# EAGLE design RadioMusic_B (EAGLE 9.4.1)
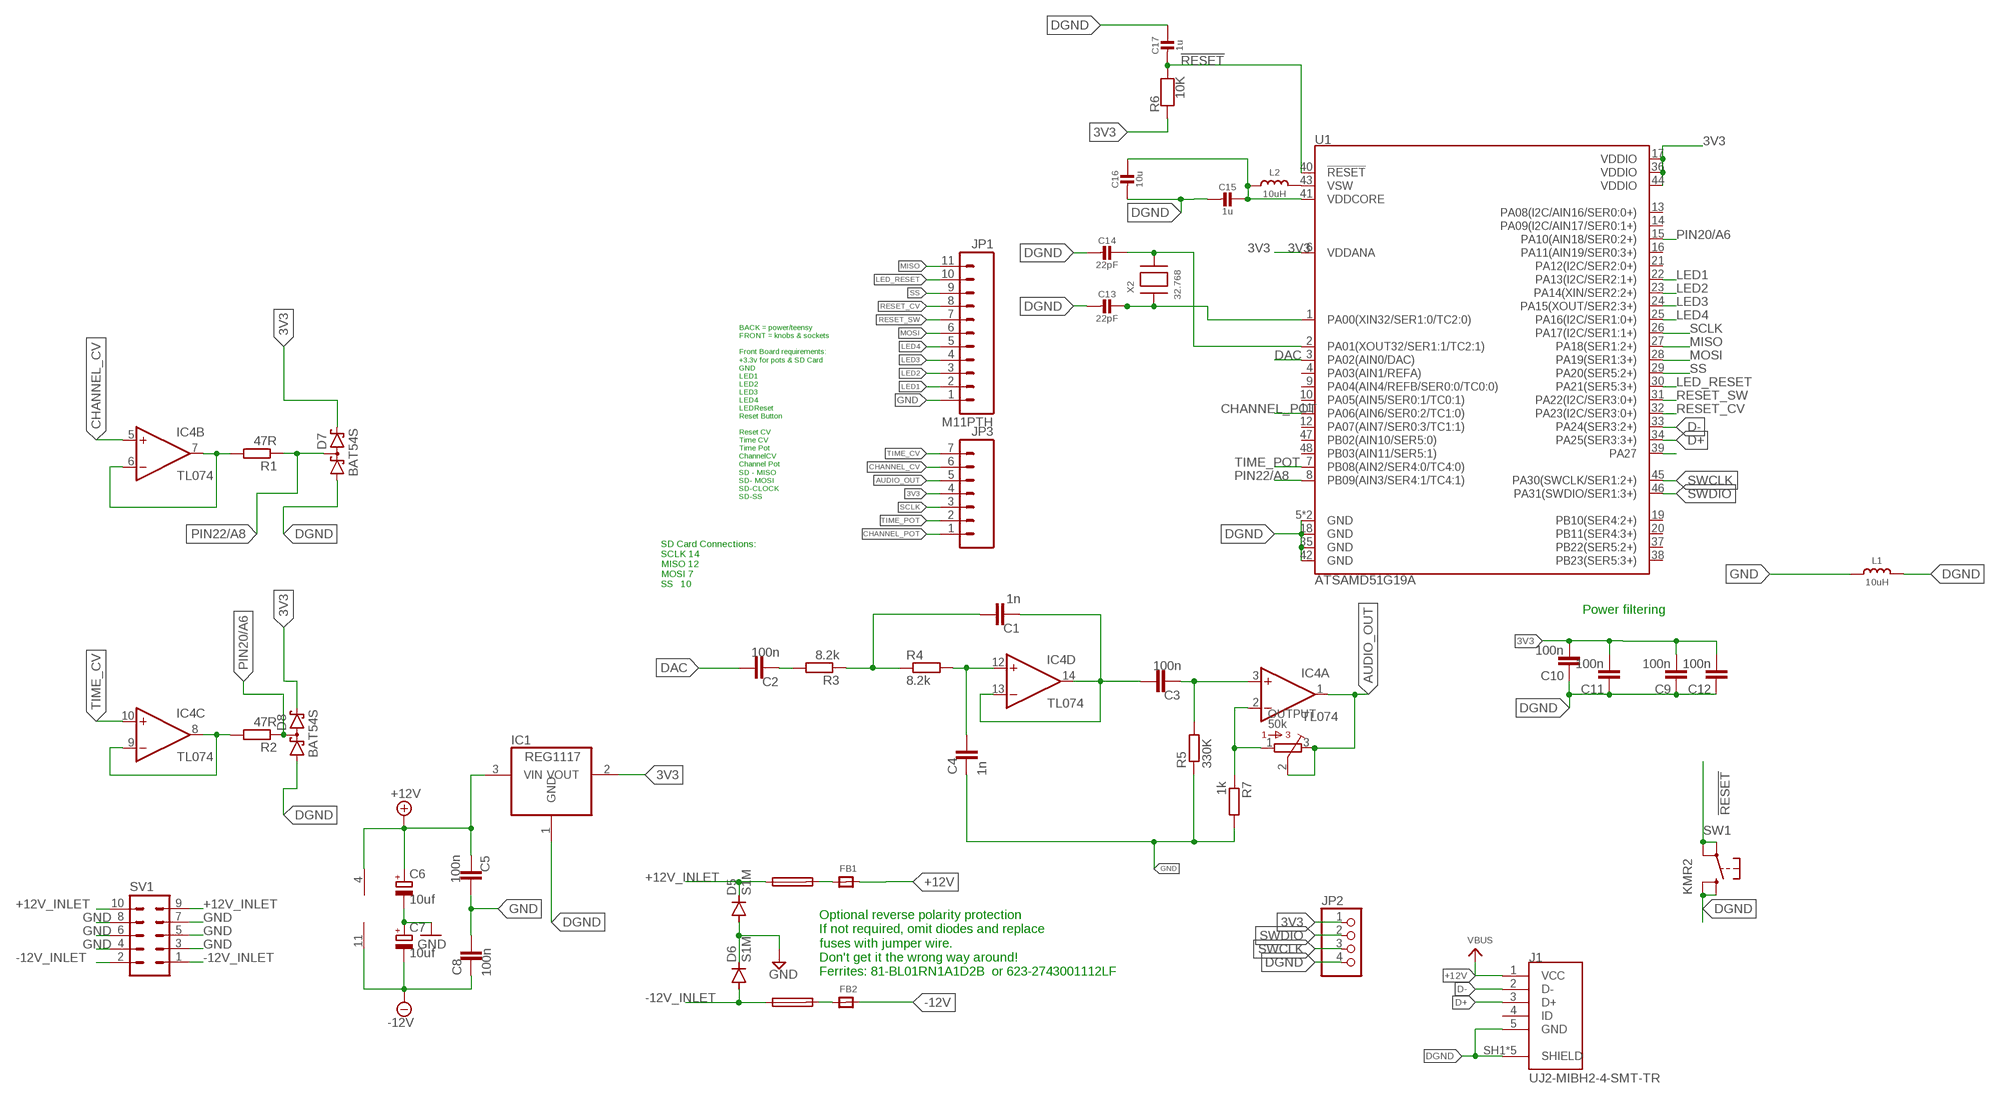
[diagram p0: schematic, sheet 1]

## Parts
C1  1n  C-EUC0603  [C0603]
C2  100n  C-EUC0603  [C0603]
C3  100n  C-EUC0603  [C0603]
C4  1n  C-EUC0603  [C0603]
C5  100n  C-EUC0603  [C0603]
C6  10uf  CPOL-EUB  [PANASONIC_B]
C7  10uf  CPOL-EUB  [PANASONIC_B]
C8  100n  C-EUC0603  [C0603]
C9  100n  C-EUC0603  [C0603]
C10  100n  C-EUC0603  [C0603]
C11  100n  C-EUC0603  [C0603]
C12  100n  C-EUC0603  [C0603]
C13  22pF  CAP_CERAMIC0603_NO  [0603-NO]
C14  22pF  CAP_CERAMIC0603_NO  [0603-NO]
C15  1u  CAP_CERAMIC0603_NO  [0603-NO]
C16  10u  CAP_CERAMIC0805-NOOUTLINE  [0805-NO]
C17  1u  CAP_CERAMIC0603_NO  [0603-NO]
D5  S1M  [SMA]
D6  S1M  [SMA]
D7  BAT54S  [SOT23]
D8  BAT54S  [SOT23]
F1  FUSE  [F1206]
F2  FUSE  [F1206]
FB1  FERRITE_0805  [_0805]
FB2  FERRITE_0805  [_0805]
IC1  REG1117  [SOT223]
IC4  TL074  TL074_SMD  [SO14]
J1  UJ2-MIBH2-4-SMT-TR  [CUI_UJ2-MIBH2-4-SMT-TR]
JP1  M11PTH  [1X11]
JP2  PINHD-1X4  [1X04]
JP3  M07  [1X07]
L1  10uH  INDUCTOR  [INDUCTOR_1007]
L2  10uH  INDUCTOR  [INDUCTOR_1007]
OUTPUT  50k  3362P  [3362P]
R1  47R  R-EU_R0603  [R0603]
R2  47R  R-EU_R0603  [R0603]
R3  8.2k  R-EU_R0603  [R0603]
R4  8.2k  R-EU_R0603  [R0603]
R5  330K  R-EU_R0603  [R0603]
R6  10K  RESISTOR_0603_NOOUT  [0603-NO]
R7  1k  R-EU_R0603  [R0603]
SV1  10_PIN_HEADER  [MA05-2]
SW1  KMR2  SWITCH_TACT_SMT4.6X2.8  [BTN_KMR2_4.6X2.8]
U1  ATSAMD51G19A  [QFN-48]
X2  32.768  XTAL-3.2X1.5  [XTAL3215]

## Nets
3V3: C9.2 C10.2 C11.2 C12.2 C15.1 C16.1 D7.2(C2) D8.2(C2) IC1.2(VOUT) JP2.1 JP3.4 L2.P$1 R6.1 U1.6(VDDANA) U1.17(VDDIO) U1.36(VDDIO) U1.41(VDDCORE) U1.44(VDDIO)
!RESET: C17.2 R6.2 SW1.A'(P1) SW1.A(P) U1.40(!RESET!)
+12V [power]: C5.2 C6.+ FB1.2 IC1.3(VIN) IC4.4(P:V+) J1.1(VCC) ; supply symbol labelled VBUS
+12V_INLET [power]: D5.C F1.1 SV1.9 SV1.10
-12V [power]: C7.- C8.2 FB2.2 IC4.11(P:V-)
-12V_INLET [power]: D6.A F2.1 SV1.1 SV1.2
AUDIO_OUT: IC4.1(A:OUT) JP3.5 OUTPUT.2 OUTPUT.3
CHANNEL_CV: IC4.5(B:+IN) JP3.6
CHANNEL_POT: JP3.1 U1.11(PA06(AIN6/SER0:2/TC1:0))
D+: J1.3(D+) U1.34(PA25(SER3:3+))
D-: J1.2(D-) U1.33(PA24(SER3:2+))
DAC: C2.1 U1.3(PA02(AIN0/DAC))
DGND: C9.1 C10.1 C11.1 C12.1 C13.2 C14.2 C15.2 C16.2 C17.1 D7.1(A1) D8.1(A1) IC1.1(GND) J1.5(GND) J1.SH1(SHIELD) J1.SH2(SHIELD) J1.SH3(SHIELD) J1.SH4(SHIELD) J1.SH5(SHIELD) JP2.4 L1.P$2 SW1.B'(S1) SW1.B(S) U1.5(GND) U1.18(GND) U1.35(GND) U1.42(GND) U1.EP(GND)
GND [gnd]: C4.2 C5.1 C6.- C7.+ C8.1 D5.A D6.C JP1.1 L1.P$1 R5.1 R7.2 SV1.3 SV1.4 SV1.5 SV1.6 SV1.7 SV1.8
LED1: JP1.2 U1.22(PA13(I2C/SER2:1+))
LED2: JP1.3 U1.23(PA14(XIN/SER2:2+))
LED3: JP1.4 U1.24(PA15(XOUT/SER2:3+))
LED4: JP1.5 U1.25(PA16(I2C/SER1:0+))
LED_RESET: JP1.10 U1.30(PA21(SER5:3+))
MISO: JP1.11 U1.27(PA18(SER1:2+))
MOSI: JP1.6 U1.28(PA19(SER1:3+))
N$1: IC4.8(C:OUT) IC4.9(C:-IN) R2.2
N$2: C4.1 IC4.12(D:+IN) R4.2
N$3: IC4.6(B:-IN) IC4.7(B:OUT) R1.2
N$4: C1.1 R3.1 R4.1
N$5: C1.2 C3.1 IC4.13(D:-IN) IC4.14(D:OUT)
N$6: C3.2 IC4.3(A:+IN) R5.2
N$7: IC4.2(A:-IN) OUTPUT.1 R7.1
N$8: C13.1 U1.1(PA00(XIN32/SER1:0/TC2:0)) X2.P$1
N$9: C14.1 U1.2(PA01(XOUT32/SER1:1/TC2:1)) X2.P$2
N$10: C2.2 R3.2
N$11: L2.P$2 U1.43(VSW)
N$13: U1.39(PA27)
N$22 [power]: F1.2 FB1.1
N$23 [power]: F2.2 FB2.1
PIN20/A6: D8.3(C1A2) R2.1 U1.15(PA10(AIN18/SER0:2+))
PIN22/A8: D7.3(C1A2) R1.1 U1.8(PB09(AIN3/SER4:1/TC4:1))
RESET_CV: JP1.8 U1.32(PA23(I2C/SER3:0+))
RESET_SW: JP1.7 U1.31(PA22(I2C/SER3:0+))
SCLK: JP3.3 U1.26(PA17(I2C/SER1:1+))
SS: JP1.9 U1.29(PA20(SER5:2+))
SWCLK: JP2.3 U1.45(PA30(SWCLK/SER1:2+))
SWDIO: JP2.2 U1.46(PA31(SWDIO/SER1:3+))
TIME_CV: IC4.10(C:+IN) JP3.7
TIME_POT: JP3.2 U1.7(PB08(AIN2/SER4:0/TC4:0))
Unconnected: J1.4(ID) U1.4(PA03(AIN1/REFA)) U1.9(PA04(AIN4/REFB/SER0:0/TC0:0)) U1.10(PA05(AIN5/SER0:1/TC0:1)) U1.12(PA07(AIN7/SER0:3/TC1:1)) U1.13(PA08(I2C/AIN16/SER0:0+)) U1.14(PA09(I2C/AIN17/SER0:1+)) U1.16(PA11(AIN19/SER0:3+)) U1.19(PB10(SER4:2+)) U1.20(PB11(SER4:3+)) U1.21(PA12(I2C/SER2:0+)) U1.37(PB22(SER5:2+)) U1.38(PB23(SER5:3+)) U1.47(PB02(AIN10/SER5:0)) U1.48(PB03(AIN11/SER5:1))

## Notes on the sheet
- BACK = power/teensy
  FRONT = knobs & sockets
  
  Front Board requirements:
  +3.3v for pots & SD Card 
  GND 
  LED1
  LED2
  LED3
  LED4
  LEDReset
  Reset Button
  
  Reset CV 
  Time CV
  Time Pot
  ChannelCV
  Channel Pot
  SD - MISO
  SD- MOSI
  SD-CLOCK
  SD-SS
- SD Card Connections: 
   SCLK 14
   MISO 12
   MOSI 7 
   SS   10
- Power filtering
- Optional reverse polarity protection
  If not required, omit diodes and replace
  fuses with jumper wire. 
  Don't get it the wrong way around! 
  Ferrites: 81-BL01RN1A1D2B  or 623-2743001112LF

## Library data of the parts
C1-C5 C8-C12 = rcl:C-EU: CAPACITOR, European symbol; SPICEPREFIX: C
C6 C7 = rcl:CPOL-EU: POLARIZED CAPACITOR, European symbol; SPICEPREFIX: C
C13-C17 = microbuilder:CAP_CERAMIC: Ceramic Capacitors For new designs, use the packages preceded by an '_' character since they are more reliable: The following footprints should be used on most boards: _0402 - Standard footprint for regular board layouts _0603 - Standard footprint for regular board layouts _0805 - Standard footprint for regular board layouts _1206 - Standard footprint for regular board layouts For extremely tight-pitch boards where space is at a premium, the following 'micro-pitch' footprints can be used (smaller pads, no silkscreen outline, etc.): _0402MP - Micro-pitch footprint for very dense/compact boards _0603MP - Micro-pitch footprint for very dense/compact boards _0805MP - Micro-pitch footprint for very dense/compact boards _1206MP - Micro-pitch footprint for very dense/compact boards
D5 D6 = diode:S1M
D7 D8 = diode:BAT54S: Schottky Diodes Pin connection corrected 2011-05-04 Source: Fairchild .. BAT54.pdf
F1 F2 = _JC:FUSE
FB1 FB2 = microbuilder:FERRITE: Ferrite Bead 0603 MMZ1608B121C - 120 Ohm @ 100MHz, 600mA, 0.15 Ohm DC Resistance - Digikey: 445-2164-1-ND BK1608HW121-T - 120 Ohm, 600mA Ferrite Chip - Digikey: 587-1876-2-ND 0805 HZ0805B272R-10 - 2.7K Ohm @ 100MHz, 200mA, 0.8 Ohm DC Resistance - Digikey: 240-2504-1-ND (see also Murata BLM21BD272SN1L) MMZ2012Y152B - 1.5K Ohm @ 100MHz, 500mA, 0.4 Ohm DC Resistance - Digikey: 445-1560-1-ND - Mainly for high frequency (80-400MHz) MMZ2012R102A - 1K Ohm @ 100MHz, 500mA, 0.3 Ohm DC Resistance - Digikey: 445-1555-2-ND - More general purpose (10-200MHz)
IC1 = burr-brown:REG1117: 800mA and 1A Low Dropout (LDO) Positive Regulator 1.8V, 2.5V, 2.85V, 3.3V, 5V, and Adj; MPN: REG1117; OC_FARNELL: 1097566; OC_NEWARK: 14P6981
IC4 = Foxfield:TL074: Generic Quad Op Amp
J1 = UJ2-MIBH2-4-SMT-TR:UJ2-MIBH2-4-SMT-TR: Micro B Type 5 Pin Horizontal 30 µin Plating SMT USB Jack 2.0; AVAILABILITY: Unavailable; CUI_PURCHASE_URL: https://www.cui.com/product/interconnect/connectors/usb-connectors/uj2-mibh2-4-smt?utm_source=snapeda.com&utm_medium=referral&utm_campaign=snapedaBOM; DESCRIPTION: Micro B, USB 2.0, 1.8 A, Right Angle, Surface Mount _SMT_, USB Receptacle; MF: CUI Inc.; MP: UJ2-MIBH2-4-SMT-TR; PACKAGE: None; PRICE: None
JP1 = SparkFun-Connectors:M11: Header 11 Standard 11-pin 0.1" header. Use with straight break away headers (SKU : PRT-00116), right angle break away headers (PRT-00553), swiss pins (PRT-00743), machine pins (PRT-00117), and female headers (PRT-00115).
JP2 = pinhead:PINHD-1X4: PIN HEADER
JP3 = SparkFun-Connectors:M07: Header 7 Standard 7-pin 0.1" header. Use with straight break away headers (SKU : PRT-00116), right angle break away headers (PRT-00553), swiss pins (PRT-00743), machine pins (PRT-00117), and female headers (PRT-00115). NOTES ON THE VARIANTS LOCK and LOCK_LONGPADS... This footprint was designed to help hold the alignment of a through-hole component (i.e. 7-pin header) while soldering it into place. You may notice that each hole has been shifted either up or down by 0.005 of an inch from it's more standard position (which is usually a perfectly straight line). This slight alteration caused the pins (the squares in the middle) to touch the edges of the holes. Because they are alternating, it causes a "brace" to hold the header in place. 0.005 has proven to be the perfect amount of "off-center" position when using our standard breakaway headers. Although looks a little odd when you look at the bare footprint, once you have a header in there, the alteration is very hard to notice. Also, if you push a header all the way into place, it is covered up entirely on the bottom side. This idea of altering the position of holes to aid alignment will be further integrated into the Sparkfun Library for other footprints. It can help hold any component with 3 or more connection pins.
L1 L2 = microbuilder:INDUCTOR: Inductors 0603: 10nH Ceramic Inductor - microwire antenna/RF (Digikey: 712-1434-2-ND) 0805: 560nH Ceramic Inductor - RF (Digikey: 553-1047-1-ND) 270nH Ceramic Inductor - Q = 40@250MHz, +-5%, 1 Ohm DC Resistance (Digikey: 535-10506-2-ND) 1007 (2518 Metric) SMT: 10µH 10% 250mOhm 820mA 1007 Inductor (Digikey: 587-2189-1-ND) 22µH 10% 500mOhm 580mA 1007 Inductor (Digikey: 587-2190-1-ND) 47µH 10% 950mOhm 420mA 1007 Inductor (Digikey: 587-2191-1-ND) 47µH 5% 100mOhm 1A 1008 Inductor (Digikey: 732-1816-1-ND) 5.0x5.0mm (Taiyo Yuden NR5040 Series) 6.8µH 20% 2.3A 64mOhm Inductor (Digikey: 587-2374-2-ND) 5.0x5.0mm (TDK VLC5045 Series) 4.7µH 20% 3.3A 34mOhm Inductor (Digikey: 445-6526-1-ND) 6.8µH 20% 2.7A 46mOhm Inductor (Digikey: 445-6527-1-ND) 6.0x6.0mm (TDK VLC6045 Series) 4.7µH 20% 3.8A 27mOhm Inductor (Digikey: 445-6538-2-ND) 6.8µH 20% 3A 41mOhm Inductor (Digikey: 445-6540-1-ND) 6.2µH 30% 2.2A 45mOhm Inductor (Digikey: SRR5028-6R2YCT-ND) - Not TDK VLC6045 but footprint should match 6.0x6.0mm (TDK SLF6045 Series) 6.8uH 30% 2A 33mOhm Inductor (Digikey: 445-4572-1-ND, Mouser: 810-SLF645T6R8N2R0PF) 6.0x6.0mm (Sumida CDRH5D28 Series) 6.2uH 30% 1.8A 45mOhm Inductor (Digikey: 308-1542-1-ND) Taiyo Yuden NR3015T2R2M - 2.2uH 20% 1.5A (Digikey: 587-1648-2-ND, Mouser: 963-NR3015T2R2M) - Used with TI TPS62172 CoilCraft RFID Transponder Coil - MA5532-AE (For use with AS3935 Lightning Sensor) Taiyo Yuden NRH2412T2R2MNGH - 2.2uH 20% 1AA (Digikey: 587-3443-1-ND) - Used with TI LM3671 Vishay IHLP 1.0uH Molded Inductor - 24mOhm DCR, 5A, +/-20%, -55°C-125°C (Digikey: 541-1319-1-ND)
OUTPUT = bourns:3362: 3362 Series 1/4" Square Trimmer
R1-R5 R7 = rcl:R-EU_: RESISTOR, European symbol; SPICEPREFIX: R
R6 = microbuilder:RESISTOR: Resistors For new designs, use the packages preceded by an '_' character since they are more reliable: The following footprints should be used on most boards: _0402 - Standard footprint for regular board layouts _0603 - Standard footprint for regular board layouts _0805 - Standard footprint for regular board layouts _1206 - Standard footprint for regular board layouts For extremely tight-pitch boards where space is at a premium, the following 'micro-pitch' footprints can be used (smaller pads, no silkscreen outline, etc.): _0402MP - Micro-pitch footprint for very dense/compact boards _0603MP - Micro-pitch footprint for very dense/compact boards _0805MP - Micro-pitch footprint for very dense/compact boards _1206MP - Micro-pitch footprint for very dense/compact boards
SV1 = TomW:10_PIN_HEADER: PIN HEADER; OC_FARNELL: unknown; OC_NEWARK: unknown
SW1 = microbuilder:SWITCH_TACT_SMT: SMT Tact Switches 6x6mm - Digikey: P12940SCT-ND KMR2 (4.6x2.8mm) - Digikey: 401-1426-1-ND EVQ-PQHB55 - Light Touch, 160GF (4.5x4.5mm) - Digikey: P8090SCT-ND KMT0 - KMT021 NGJ LHS (etc.) IP68/Waterproof - Digikey: CKN10289CT-ND
U1 = SparkFun-IC-Microcontroller:ATSAMD51G19A
X2 = adafruit2:XTAL: Low cost SMT crystals, no capacitors included http://www.ladyada.net/library/eagle

## Net classes
1 power: width 0.305 mm
2 gnd: width 0.254 mm

## Board
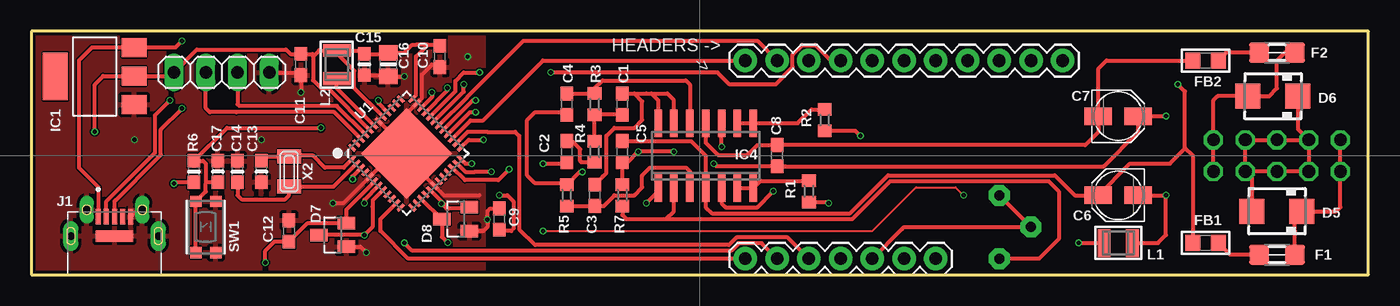
[diagram p1: board, top side]
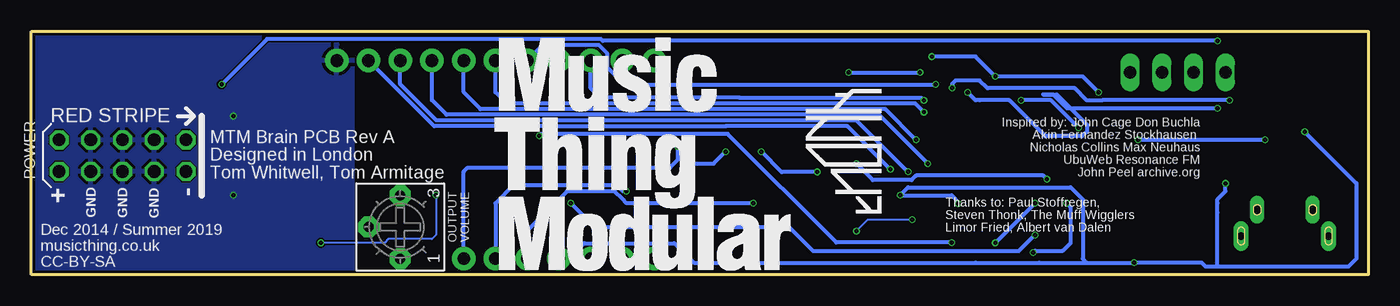
[diagram p2: board, bottom side, seen from below]

Size 107 x 19.5 mm. Coordinates in mm from the lower left corner, seen from the top.
Outline: 0,19.5 0,0 107,0 107,19.5 0,19.5
Copper layers (1*16): Top 0.035559375mm / dielectric 1.6mm / Bottom 0.035559375mm
Design rules "jlcpcb2layer": minimum track width 5mil, minimum drill 12mil, track to track 5mil, track to pad 5mil, pad to pad 5mil, via to via 5mil, smd to smd 5mil, copper to edge 8mil, drill to drill 6mil, minimum pad ring 5mil, minimum via ring 3mil, stop-mask expansion 2.5mil, vias tented up to drill 0mil, thermal gap 10mil

### Footprints (pad centres in the part's own frame; a part is rotated, then mirrored left to right if it is on the bottom)
C0603 = smd 1.1 x 1: 1 -0.85,0; 2 0.85,0
PANASONIC_B = smd 2.2 x 1.4: + 1.6,0; - -1.6,0
0603-NO = smd 1.075 x 1: 1 -0.85,0; 2 0.85,0
0805-NO = smd 1.24 x 1.5: 1 -0.95,0; 2 0.95,0
SMA = smd 2 x 2: A 2,0; C -2,0
SOT23 = smd 1 x 1.4: 1 -0.95,-1.1; 2 0.95,-1.1; 3 0,1.1
F1206 = smd 1.6 x 1.6: 1 -1.429,0; 2 1.429,0
_0805 = smd 1.2 x 1.3: 1 -1.016,0; 2 1.016,0
SOT223 = smd 1.499 x 2.007: 1 -2.261,-3.15; 2 0.025,-3.15; 3 2.311,-3.15 | smd 3.81 x 2.007: 4 0,3.15
SO14 = smd 0.6 x 2.2: 1 -3.81,-2.6; 2 -2.54,-2.6; 3 -1.27,-2.6; 4 0,-2.6; 5 1.27,-2.6; 6 2.54,-2.6; 7 3.81,-2.6; 8 3.81,2.6; 9 2.54,2.6; 10 1.27,2.6; 11 0,2.6; 12 -1.27,2.6; 13 -2.54,2.6; 14 -3.81,2.6
CUI_UJ2-MIBH2-4-SMT-TR = smd 0.4 x 1.2: 1 -1.3,2.1; 2 -0.65,2.1; 3 0,2.1; 4 0.65,2.1; 5 1.3,2.1 | drill 0.6 pad 1.2 long: SH1 -3.5,0.55; SH4 3.5,0.55 | drill 0.65 pad 1.1 long: SH2 -2.225,2.65; SH3 2.225,2.65 | smd 3 x 0.9: SH5 0,0.55
1X11 = drill 1.016 pad 1.88: 1 0,0; 2 2.54,0; 3 5.08,0; 4 7.62,0; 5 10.16,0; 6 12.7,0; 7 15.24,0; 8 17.78,0; 9 20.32,0; 10 22.86,0; 11 25.4,0
1X04 = drill 1.016 long: 1 -3.81,0; 2 -1.27,0; 3 1.27,0; 4 3.81,0
1X07 = drill 1.016 pad 1.88: 1 0,0; 2 2.54,0; 3 5.08,0; 4 7.62,0; 5 10.16,0; 6 12.7,0; 7 15.24,0
INDUCTOR_1007 = smd 1.016 x 2.2: P$1 -1.127,0; P$2 1.127,0
3362P = drill 0.813 pad 1.676 octagon: 1 -2.54,0; 2 0,2.54; 3 2.54,0
R0603 = smd 1 x 1.1: 1 -0.85,0; 2 0.85,0
MA05-2 = drill 1.016 octagon: 1 -5.08,-1.27; 2 -5.08,1.27; 3 -2.54,-1.27; 4 -2.54,1.27; 5 0,-1.27; 6 0,1.27; 7 2.54,-1.27; 8 2.54,1.27; 9 5.08,-1.27; 10 5.08,1.27
BTN_KMR2_4.6X2.8 = smd 0.9 x 0.9: A 2.05,0.8; A' -2.05,0.8; B 2.05,-0.8; B' -2.05,-0.8
QFN-48 = smd 0.7 x 0.25: 1 -3.4,2.75; 2 -3.4,2.25; 3 -3.4,1.75; 4 -3.4,1.25; 5 -3.4,0.75; 6 -3.4,0.25; 7 -3.4,-0.25; 8 -3.4,-0.75; 9 -3.4,-1.25; 10 -3.4,-1.75; 11 -3.4,-2.25; 12 -3.4,-2.75; 25 3.4,-2.75; 26 3.4,-2.25; 27 3.4,-1.75; 28 3.4,-1.25; 29 3.4,-0.75; 30 3.4,-0.25; 31 3.4,0.25; 32 3.4,0.75; 33 3.4,1.25; 34 3.4,1.75; 35 3.4,2.25; 36 3.4,2.75 | smd 0.25 x 0.7: 13 -2.75,-3.4; 14 -2.25,-3.4; 15 -1.75,-3.4; 16 -1.25,-3.4; 17 -0.75,-3.4; 18 -0.25,-3.4; 19 0.25,-3.4; 20 0.75,-3.4; 21 1.25,-3.4; 22 1.75,-3.4; 23 2.25,-3.4; 24 2.75,-3.4; 37 2.75,3.4; 38 2.25,3.4; 39 1.75,3.4; 40 1.25,3.4; 41 0.75,3.4; 42 0.25,3.4; 43 -0.25,3.4; 44 -0.75,3.4; 45 -1.25,3.4; 46 -1.75,3.4; 47 -2.25,3.4; 48 -2.75,3.4 | smd 5.15 x 5.15: EP 0,0
XTAL3215 = smd 1.1 x 1.9: P$1 1.2,0; P$2 -1.2,0

### Placement (x,y rotation side)
C1  47.31,13.65 90 top
C2  42.86,9.84 90 top
C3  45.09,6.35 270 top
C4  42.86,13.65 270 top
C5  47.31,9.84 90 top
C6  87,6.35 180 top
C7  87,12.7 0 top
C8  59.69,9.53 90 top
C9  37.47,4.45 270 top
C10  32.7,17.46 90 top
C11  21.59,16.83 90 top
C12  20.64,3.49 270 top
C13  18.41,8.26 270 top
C14  16.51,8.26 90 top
C15  26.67,16.83 270 top
C16  28.57,16.83 270 top
C17  14.92,8.26 270 top
D5  99.69,5.08 180 top
D6  99.38,14.29 180 top
D7  24.13,3.17 90 top
D8  33.97,4.45 90 top
F1  99.69,1.59 180 top
F2  99.69,17.78 180 top
FB1  93.98,2.54 180 top
FB2  93.98,17.14 180 top
IC1  5.08,15.88 90 top
IC4  53.98,9.53 0 top
J1  6.67,2.54 0 top
JP1  82.55,17.14 180 top
JP2  15.24,16.19 0 top
JP3  57.15,1.27 0 top
L1  87,2.54 180 top
L2  24.45,16.83 270 top
OUTPUT  77.47,3.81 90 bottom
R1  62.23,6.67 90 top
R2  63.5,12.38 90 top
R3  45.09,9.84 270 top
R4  45.09,13.65 90 top
R5  42.86,6.35 270 top
R6  13.02,8.26 90 top
R7  47.31,6.35 90 top
SV1  99.69,9.53 180 bottom
SW1  13.97,3.81 90 top
U1  30.03,9.71 45 top
U$2  [THONK_1CM_SCREENPRINT]  38.96,4.9 90 bottom
U$4  [MTM_2CM]  70.08,-0.64 0 bottom
X2  20.64,8.26 90 top

### Tracks (layer width: path | path; a pad name or v marks a point on that pad's centre or on a via)
3V3  (via drill 0.35)
  Top 0.305: v5.08,11.43 5.08,15.24 5.74,15.9 IC1.2 11.14,15.9 JP2.1 13.26,18.02 20.4,18.02 20.74,17.68 C11.2 22.5,17.68 22.54,17.64 22.54,17.46 | U1.17 33.39,5.29 | U1.6 27.45,7.42 25.23,5.21 D7.2 22.12,4.12 C12.2 19.47,2.64 18.73,1.91 v18.73,0.95 | L2.P$1 24.77,17.95 26.39,17.95 C15.1 28.48,17.68 C16.1 29.84,17.78 30.48,18.41 30.8,18.41 31.75,18.41 | U1.41 25.85,14.95 25.85,16.34 24.45,17.74 L2.P$1 | 31.75,18.41 32.6,18.41 C10.2 | U1.36 30.8,14.37 30.8,17.46 31.75,18.41 | U1.44 23.79,14.89 23.22,14.89 22.54,15.57 22.54,17.46 | 33.39,5.29 34.97,5.29 D8.2 | 22.54,17.46 23.04,17.95 L2.P$1 | v37.47,6.35 38.1,6.35 38.59,5.86 38.59,3.67 38.42,3.49 37.57,3.49 C9.2 | 33.39,5.29 33.23,5.29 v32.83,5.69 | v11.43,7.3 11.53,7.41 R6.1
  Bottom 0.305: JP3.4 63.99,1.27 62.75,2.52 55.54,2.52 53.98,0.95 31.43,0.95 26.35,0.95 22.54,0.95 | 22.54,0.95 v18.73,0.95 13.34,0.95 13.02,0.64 12.06,0.64 | 22.54,0.95 22.86,1.27 22.86,6.03 23.81,6.99 36.83,6.99 v37.47,6.35 33.34,6.35 32.7,5.71 32.73,5.69 v32.83,5.69 | v5.08,11.43 0.95,7.3 0.95,1.27 1.59,0.64 12.06,0.64 | 12.06,0.64 12.06,4.96 12.07,4.97 12.07,5.72 12.06,5.73 12.06,6.03 11.43,6.67 v11.43,7.3
!RESET  (via drill 0.35)
  Top 0.305: SW1.A' SW1.A 13.97,6.66 13.97,7.3 | 13.97,7.3 14.07,7.41 C17.2 | 13.97,7.3 13.97,8.89 13.76,9.11 R6.2 15.66,11.75 v23.18,11.75 | U1.40 27.79,13.72 v27.79,13.95
  Bottom 0.305: v23.18,11.75 25.4,13.97 27.76,13.97 v27.79,13.95
+12V  (via drill 0.35)
  Top 0.305: C5.2 52.81,10.69 53.98,9.53 IC4.4 53.98,5.4 54.47,4.9 65.52,4.9 68.57,7.95 81.9,7.95 83.5,6.35 C6.+ 87.94,8.89 91.12,8.89 92.33,10.1 92.33,10.16 | v12.06,18.73 11.52,18.19 IC1.3 4.85,18.19 3.81,17.14 3.81,8.57 5.37,7.01 J1.1 | FB1.2 92.96,9.53 92.33,10.16 | 92.33,10.16 92.33,14.67 v91.76,15.24
  Bottom 0.305: v12.06,18.73 61.27,18.73 61.41,18.87 88.12,18.87 v91.76,15.24
+12V_INLET
  Top 0.305: SV1.9 SV1.10 104.78,5.4 104.46,5.08 D5.C 101.12,4.51 101.12,3.49 F1.1
-12V
  Top 0.305: FB2.2 86.04,17.14 85.41,16.51 85.41,12.71 C7.- 85.39,11.42 84.35,10.38 C8.2 58.1,10.38 57.31,9.58 54.97,9.58 53.98,10.58 IC4.11
-12V_INLET
  Top 0.305: SV1.2 SV1.1 94.61,13.97 94.93,14.29 D6.A 99.06,14.29 99.69,14.92 99.69,17.14 100.33,17.78 F2.1
AUDIO_OUT  (via drill 0.35)
  Top 0.305: OUTPUT.3 OUTPUT.2 69.85,3.81 69.69,3.65 JP3.5 | v49.21,5.71 50.16,6.67 IC4.1
  Bottom 0.305: JP3.5 67.31,3.49 64.14,6.67 60.3,6.67 59.68,6.04 59.35,5.71 58.42,5.71 v49.21,5.71
CHANNEL_CV  (via drill 0.35)
  Top 0.305: IC4.5 55.24,5.71 55.56,5.4 58.1,5.4 v59.37,6.67
  Bottom 0.305: JP3.6 69.85,5.71 68.44,7.12 60.11,7.12 59.66,6.67 v59.37,6.67
CHANNEL_POT
  Top 0.305: JP3.1 30.16,1.27 27.94,3.49 27.94,4.45 U1.11
D+  (via drill 0.35)
  Top 0.305: v32.07,14.61 32.07,14.22 U1.34 | v12.06,13.31 10.37,11.62 10.37,9.58 10.08,9.29 6.74,5.96 6.67,5.88 J1.3
  Bottom 0.305: 25.21,14.43 26.04,14.43 25.21,14.43 | v12.06,13.31 24.1,13.31 25.21,14.43 | 25.21,14.43 24.93,14.43 22.52,12.02 22.52,11.47 22.91,11.09 25.86,11.09 28.74,13.97 31.11,13.97 31.43,13.97 v32.07,14.61 | v32.07,14.61
D-  (via drill 0.35)
  Top 0.305: U1.33 33.29,14.74 v33.29,14.96 | v11.11,13.97 9.91,12.77 9.91,9.77 6.16,6.02 6.02,5.88 J1.2
  Bottom 0.305: v11.11,13.97 21.3,13.97 21.32,13.95 22.52,13.95 23.5,14.92 30.48,14.92 31.11,15.56 33.02,15.56 33.3,15.28 v33.3,14.96 v33.29,14.96
DAC  (via drill 0.35)
  Top 0.305: U1.3 25.72,7.87 v25.72,7.64 | v25.72,7.64 25.72,7.62 v25.72,7.64 | v40.96,8.89 42.76,8.89 C2.1
  Bottom 0.305: v25.72,7.64 26.01,7.94 36.2,7.94 36.56,7.58 39.64,7.58 v40.96,8.89
DGND  (via drill 0.35)
  Top 0.152: v40.96,3.49 64.77,3.49 67.31,3.49 70.8,6.99 73.98,6.99 v74.61,6.35 | J1.5 7.94,4.67 | 36.51,4.45 v36.51,4.39 36.51,4.45
  Top 0.305: D7.1 26.35,2.23 v26.83,1.75 | D8.1 36.2,3.49 | D8.1 | 35.88,6.35 33.04,6.35 U1.18 29.68,9.71 29.53,9.71 U1.EP | v29.84,15.88 C16.2 28.48,15.98 C15.2 | v24.13,5.71 24.97,5.71 U1.5 27.83,8.57 28.89,8.57 U1.EP | v21.59,14.61 C11.1 21.38,16.19 JP2.4 | C10.1 32.49,16.83 32.07,16.83 31.27,16.03 31.27,14.13 31.11,13.97 U1.35 30.16,13.02 30.16,12.92 28.67,11.43 | v83.82,2.54 L1.P$2 | C9.1 36.73,5.29 36.51,5.08 v36.51,4.39 36.51,3.81 36.2,3.49 | U1.EP 28.67,11.08 28.67,11.43 | U1.42 28.67,11.43 | 28.67,11.43 | 36.2,3.49 D8.1 | 7.94,4.67 J1.5 8.52,5.19 J1.SH3
  Bottom 0.152: v36.51,4.39 40.06,4.39 v40.96,3.49 | v74.61,6.35 74.61,3.17 74.93,2.86 78.42,2.86 78.74,2.54 v83.82,2.54
  Bottom 0.305: v26.83,1.75 26.67,1.91 24.45,1.91 23.81,2.54 23.81,5.4 v24.13,5.71 | v21.59,14.61 22.86,15.88 v29.84,15.88 31.43,17.46 v34.92,17.46 | v8.26,10.79 v18.41,10.79
  pour Top: -1.27,-1.27 36.2,-1.27 36.2,20.95 -1.27,20.95
GND  (via drill 0.35)
  Top 0.305: SV1.4 SV1.3 SV1.5 SV1.7 | SV1.7 SV1.8 SV1.6 SV1.4 | v90.81,12.7 C7.+ 88.59,11.44 85.83,8.68 60.33,8.68 C8.1 54.83,8.68 54.61,8.89 v54.63,8.89 | C6.- v90.81,6.35 90.81,3.17 90.17,2.54 L1.P$1 | C4.2 42.65,13.02 40.32,13.02 39.69,12.38 39.69,7.94 40.32,7.3 42.76,7.3 R5.1 43.92,8.26 44.13,8.26 v44.09,8.22 | R7.2 C5.1 47.73,8.99 v48.58,9.84 v51.44,9.84 | v54.63,8.89 | SV1.4 97.69,7.71 D5.A | D6.C 101.38,11.65 SV1.7
  Bottom 0.305: v44.09,8.22 46.95,8.22 v48.58,9.84 | v54.63,8.89 52.39,8.89 v51.44,9.84
  pour Bottom: 81.28,20.32 107.95,20.32 107.95,-1.27 81.28,-1.27
LED1  (via drill 0.35)
  Top 0.305: U1.22 33.73,8.54 34.7,7.58 37.39,7.58 v38.24,8.43
  Bottom 0.305: JP1.2 74.77,11.91 74.75,11.89 65.41,11.89 51.44,11.89 41.7,11.89 v38.24,8.43
LED2  (via drill 0.35)
  Top 0.305: U1.23 34.09,8.9 34.75,8.23 35.52,8.23 35.54,8.26 36.83,8.26 v36.83,8.23
  Bottom 0.305: JP1.3 77.47,15.25 74.56,12.34 40.94,12.34 v36.83,8.23
LED3  (via drill 0.35)
  Top 0.305: U1.24 34.74,8.89 v35.24,8.89
  Bottom 0.305: JP1.4 74.93,13.97 73.76,12.8 39.15,12.8 v35.24,8.89
LED4  (via drill 0.35)
  Top 0.305: U1.25 35,10.79 v36.2,10.79
  Bottom 0.305: JP1.5 72.39,14.61 71.04,13.26 38.66,13.26 v36.2,10.79
LED_RESET
  Top 0.305: U1.30 34.9,14.23 34.9,14.24 39.39,18.73 58.1,18.73 JP1.10
MISO
  Top 0.305: JP1.11 40.96,17.14 36.17,12.36 35.16,12.36 U1.27
MOSI  (via drill 0.35)
  Top 0.305: U1.28 35.1,13.02 v35.56,13.02
  Bottom 0.305: JP1.6 69.85,14.61 68.96,13.72 36.26,13.72 v35.56,13.02
N$1
  Top 0.305: IC4.9 IC4.8 61.34,12.12 62.45,13.23 R2.2
N$2
  Top 0.305: C4.1 R4.2 45.09,14.92 45.72,15.56 52.39,15.56 52.7,15.24 IC4.12
N$3
  Top 0.305: IC4.6 IC4.7 58.38,7.52 R1.2
N$4
  Top 0.305: C1.1 R4.1 R3.1
N$5
  Top 0.305: C1.2 48.26,14.5 | 48.26,14.5 49.21,14.5 | 49.21,14.5 49.63,14.5 50.16,13.97 50.16,13.02 IC4.14 | 49.21,14.5 50.9,14.5 51.44,13.97 IC4.13 | C3.1 45.76,7.87 46.04,8.15 46.04,11.11 46.67,11.75 48.26,11.75 48.9,12.38 48.9,13.87 48.26,14.5
N$6
  Top 0.305: IC4.3 52.7,8.26 52.39,8.57 49.53,8.57 48.9,7.94 48.9,6.99 48.26,6.35 46.68,6.35 45.83,5.5 C3.2 R5.2
N$7
  Top 0.305: R7.1 47.31,4.76 47.62,4.45 50.48,4.45 | IC4.2 51.44,5.08 50.8,4.45 50.48,4.45 | 50.48,4.45 65.71,4.45 68.76,7.49 81.41,7.49 82.23,6.67 82.23,2.86 80.64,1.27 OUTPUT.1
N$8
  Top 0.305: U1.1 25,8.57 23.5,8.57 22.54,9.53 20.71,9.53 X2.P$1 18.77,9.46 C13.1
N$9
  Top 0.305: U1.2 24.19,7.05 X2.P$2 20.64,6.35 20.32,6.03 16.83,6.03 16.51,6.35 C14.1
N$10
  Top 0.305: R3.2 44.03,8.99 43.92,9.1 43.92,9.57 43.92,10.05 43.28,10.69 C2.2
N$11
  Top 0.305: U1.43 24.45,14.94 L2.P$2
N$22
  Top 0.305: FB1.1 95.95,1.59 F1.2
N$23
  Top 0.305: FB2.1 95.63,17.78 F2.2
PIN20/A6  (via drill 0.35)
  Top 0.305: U1.15 32.82,4.45 D8.3 32.87,3 33.34,2.54 v33.34,2.56 | R2.1 65.94,11.53 v66.36,11.11
  Bottom 0.305: v33.34,2.56 42.57,2.56 51.28,11.27 66.2,11.27 v66.36,11.11
PIN22/A8  (via drill 0.35)
  Top 0.305: U1.8 27.33,5.95 27.33,5.44 27.3,5.42 27.3,3.81 v26.67,3.17 D7.3 | R1.1 63.72,5.82 v63.82,5.71
  Bottom 0.305: v63.82,5.71 61.91,3.81 46.35,3.81 44.43,1.88 27.96,1.88 v26.67,3.17
RESET_CV  (via drill 0.35)
  Top 0.305: JP1.8 63.99,17.14 62.75,18.39 61.71,18.39 60.94,17.61 60.94,16.63 59.55,15.24 55.88,15.24 54.93,16.19 v41.59,16.19 | v35.88,16.19 34.61,16.19 34.61,16.17 33.95,15.51 33.95,14.69 U1.32
  Bottom 0.305: v41.59,16.19 v35.88,16.19
RESET_SW  (via drill 0.35)
  Top 0.305: U1.31 34.61,14.64 v34.61,15.24
  Bottom 0.305: JP1.7 66.04,18.41 61.59,18.41 60.94,17.75 60.94,16.63 59.55,15.24 v34.61,15.24
SCLK
  Top 0.305: JP3.3 60.53,2.97 56.45,2.97 55.84,2.36 40.32,2.36 39.05,3.63 39.05,11.11 38.73,11.43 36.49,11.43 36.47,11.45 34.95,11.45 U1.26
SS  (via drill 0.35)
  Top 0.305: U1.29 35.35,13.97 v35.56,13.97
  Bottom 0.305: JP1.9 62.23,14.92 61.48,14.17 50.3,14.17 35.76,14.17 v35.56,13.97
SWCLK
  Top 0.305: U1.45 24.46,13.52 16.64,13.52 16.51,13.65 JP2.3
SWDIO
  Top 0.305: U1.46 24.25,13.02 16.44,13.02 14.29,13.02 13.97,13.34 JP2.2
TIME_CV  (via drill 0.35)
  Top 0.305: v55.24,10.24 IC4.10
  Bottom 0.305: JP3.7 72.39,8.26 72.07,8.57 55.88,8.57 55.24,9.21 v55.24,10.24
TIME_POT  (via drill 0.35)
  Top 0.305: JP3.2 58.45,2.52 56.63,2.52 56.02,1.91 30.48,1.91 v29.84,2.54 | v26.67,5.71 26.67,6 U1.7
  Bottom 0.305: v29.84,2.54 v26.67,5.71

### Text on the board
tPlace: HEADERS -> | ->
bPlace: Inspired by: John Cage Don Buchla / Akin Fernandez Stockhausen / Nicholas Collins Max Neuhaus / UbuWeb Resonance FM / John Peel archive.org | Thanks to: Paul Stoffregen, / Steven Thonk, The Muff Wigglers / Limor Fried, Albert van Dalen | MTM Brain PCB Rev A / Designed in London / Tom Whitwell, Tom Armitage | OUTPUT / VOLUME | Dec 2014 / Summer 2019 / musicthing.co.uk / CC-BY-SA
tValues: 3V3 | IO | CLK | GND
bValues: 3V3 | IO | CLK | GND